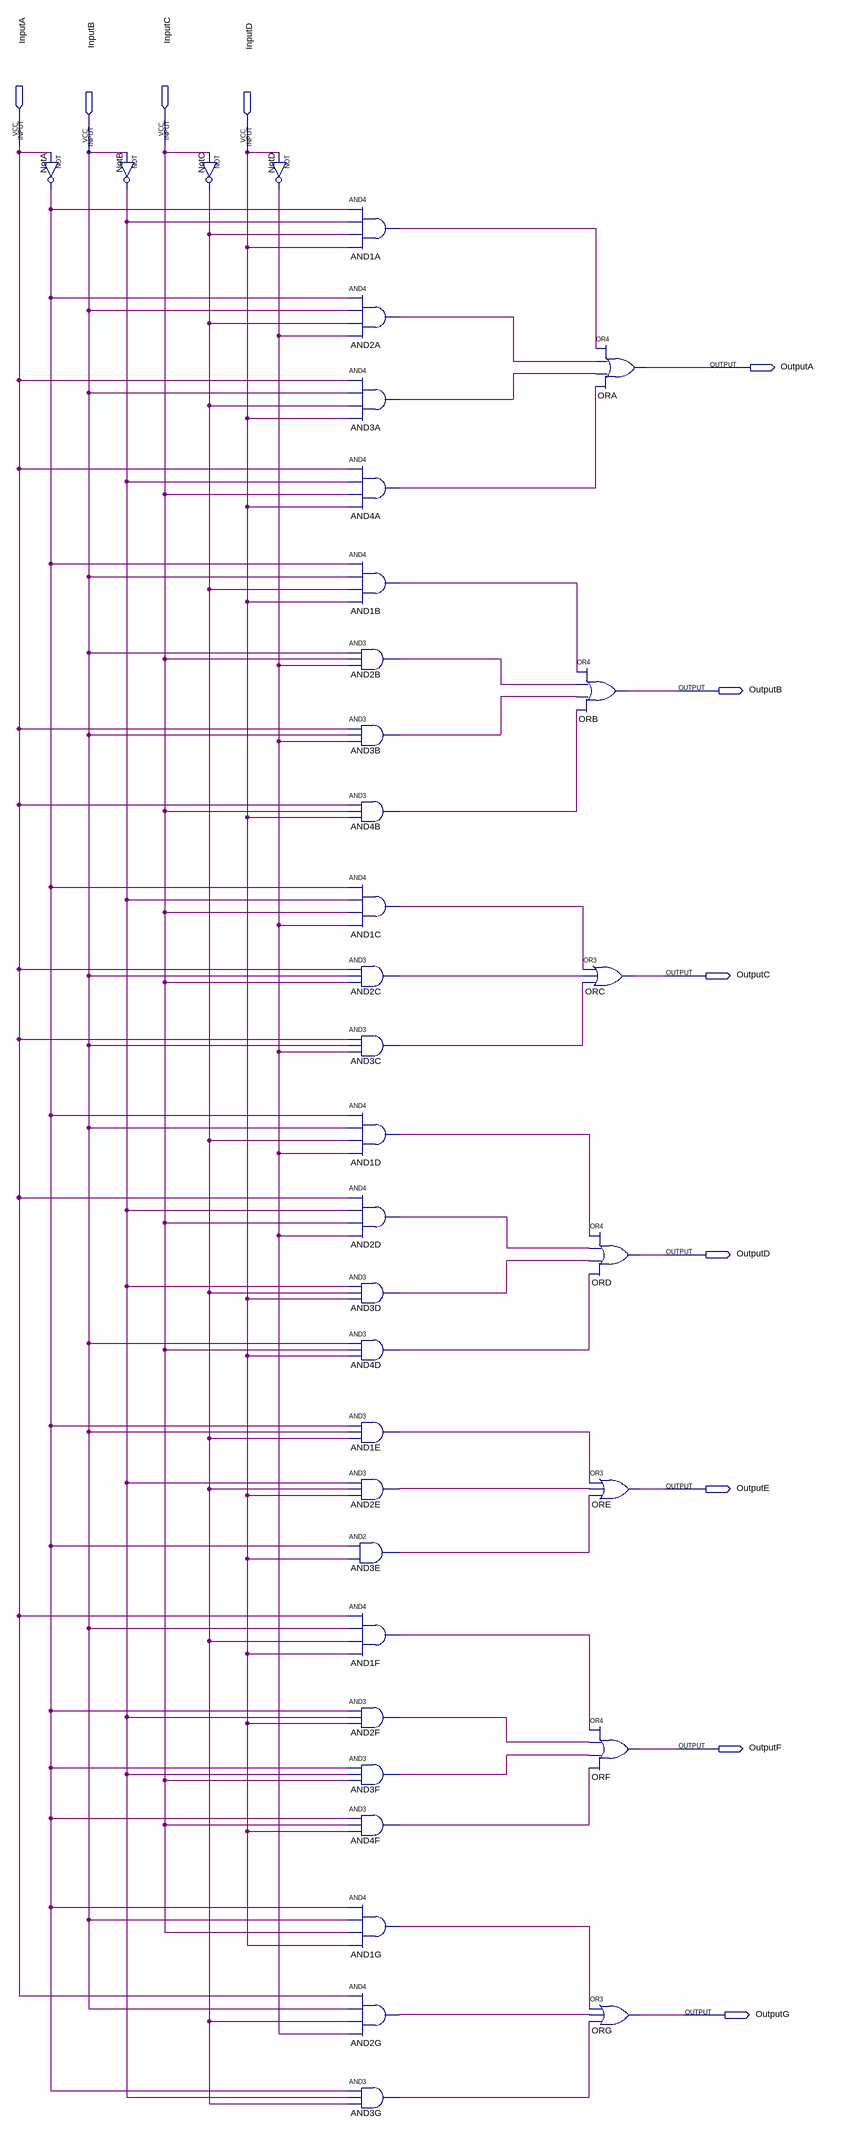
[diagram p0: schematic sheet]
// Quartus schematic Lab4_and_5.bdf as structural Verilog: 36 symbols, 11 pins
module Lab4_and_5 (
  input  InputA,
  input  InputC,
  input  InputB,
  input  InputD,
  output OutputA,
  output OutputB,
  output OutputC,
  output OutputD,
  output OutputE,
  output OutputF,
  output OutputG
);

  wire AND1A_out, AND1B_out, AND1C_out, AND1D_out, AND1E_out, AND1F_out, AND1G_out, AND2A_out, AND2B_out,
       AND2C_out, AND2D_out, AND2E_out, AND2F_out, AND2G_out, AND3A_out, AND3B_out, AND3C_out, AND3D_out,
       AND3E_out, AND3F_out, AND3G_out, AND4A_out, AND4B_out, AND4D_out, AND4F_out, NotA_out, NotB_out,
       NotC_out, NotD_out;

  not NotA (NotA_out, InputA);
  not NotB (NotB_out, InputB);
  not NotC (NotC_out, InputC);
  not NotD (NotD_out, InputD);
  and AND1A (AND1A_out, NotA_out, NotB_out, NotC_out, InputD);
  and AND2A (AND2A_out, NotA_out, InputB, NotC_out, NotD_out);
  and AND3A (AND3A_out, InputA, InputB, NotC_out, InputD);
  and AND4A (AND4A_out, InputA, NotB_out, InputC, InputD);
  and AND1B (AND1B_out, NotA_out, InputB, NotC_out, InputD);
  and AND2B (AND2B_out, InputB, InputC, NotD_out);
  and AND3B (AND3B_out, InputA, InputB, NotD_out);
  and AND4B (AND4B_out, InputA, InputC, InputD);
  and AND1C (AND1C_out, NotA_out, NotB_out, InputC, NotD_out);
  and AND2C (AND2C_out, InputA, InputB, InputC);
  and AND3C (AND3C_out, InputA, InputB, NotD_out);
  and AND1D (AND1D_out, NotA_out, InputB, NotC_out, NotD_out);
  and AND2D (AND2D_out, InputA, NotB_out, InputC, NotD_out);
  and AND3D (AND3D_out, NotB_out, NotC_out, InputD);
  and AND4D (AND4D_out, InputB, InputC, InputD);
  and AND1E (AND1E_out, NotA_out, InputB, NotC_out);
  and AND2E (AND2E_out, NotB_out, NotC_out, InputD);
  and AND3E (AND3E_out, NotA_out, InputD);
  and AND1F (AND1F_out, InputA, InputB, NotC_out, InputD);
  and AND2F (AND2F_out, NotA_out, NotB_out, InputD);
  and AND3F (AND3F_out, NotA_out, NotB_out, InputC);
  and AND4F (AND4F_out, NotA_out, InputC, InputD);
  and AND1G (AND1G_out, NotA_out, InputB, InputC, InputD);
  and AND2G (AND2G_out, InputA, InputB, NotC_out, NotD_out);
  and AND3G (AND3G_out, NotA_out, NotB_out, NotC_out);
  or ORB (OutputB, AND1B_out, AND2B_out, AND3B_out, AND4B_out);
  or ORC (OutputC, AND1C_out, AND2C_out, AND3C_out);
  or ORD (OutputD, AND1D_out, AND2D_out, AND3D_out, AND4D_out);
  or ORE (OutputE, AND1E_out, AND2E_out, AND3E_out);
  or ORF (OutputF, AND1F_out, AND2F_out, AND3F_out, AND4F_out);
  or ORG (OutputG, AND1G_out, AND2G_out, AND3G_out);
  or ORA (OutputA, AND1A_out, AND2A_out, AND3A_out, AND4A_out);
endmodule
